# EAGLE design LED-bas (EAGLE 7.6.0)
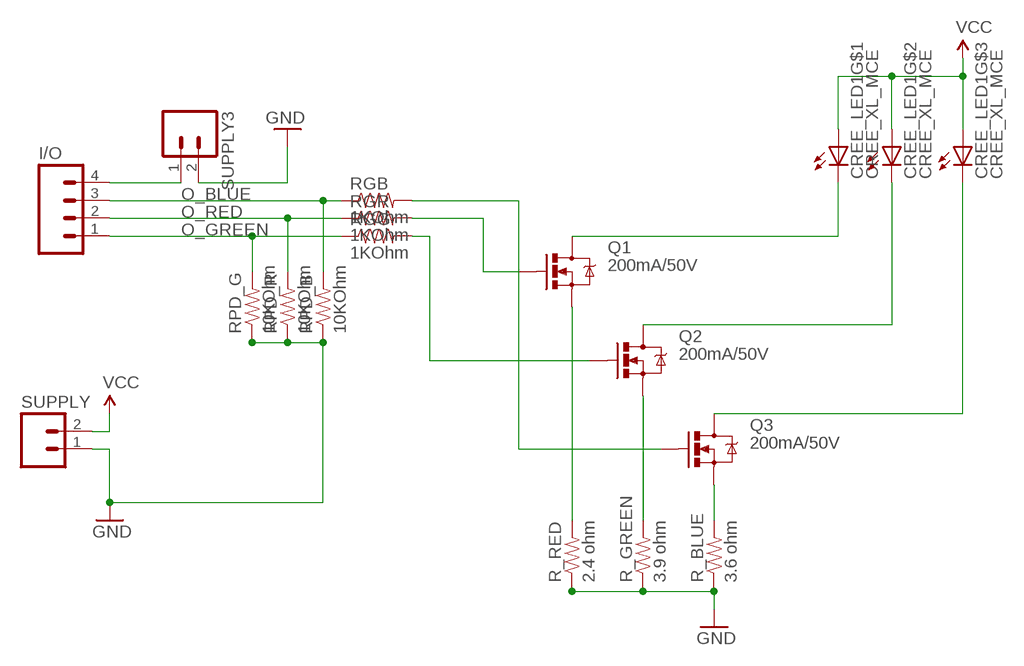
[diagram p0: schematic, sheet 1]

## Parts
CREE_LED1  CREE_XL_MCE  [CREE_XL_MCE]
I/O  M04NO_SILK_ALL_ROUND  [1X04_NO_SILK_ALL_ROUND]
Q1  200mA/50V  MOSFET-NCHANNELBSS138  [SOT23-3]
Q2  200mA/50V  MOSFET-NCHANNELBSS138  [SOT23-3]
Q3  200mA/50V  MOSFET-NCHANNELBSS138  [SOT23-3]
R_BLUE  3.6 ohm  RESISTOR0805-RES  [0805]
R_GREEN  3.9 ohm  RESISTOR0805-RES  [0805]
R_RED  2.4 ohm  RESISTOR0805-RES  [0805]
RGB  1KOhm  RESISTOR0805-RES  [0805]
RGG  1KOhm  RESISTOR0805-RES  [0805]
RGR  1KOhm  RESISTOR0805-RES  [0805]
RPD_B  10KOhm  RESISTOR0805-RES  [0805]
RPD_G  10KOhm  RESISTOR0805-RES  [0805]
RPD_R  10KOhm  RESISTOR0805-RES  [0805]
SUPPLY  M021X02_NO_SILK  [1X02_NO_SILK]
SUPPLY3  M021X02_NO_SILK  [1X02_NO_SILK]

## Nets
GND: R_BLUE.1 R_GREEN.1 R_RED.1 RPD_B.1 RPD_G.1 RPD_R.1 SUPPLY3.2 SUPPLY.1
N$1 [SUPPLY]: Q3.2(S) R_BLUE.2
N$2 [SUPPLY]: Q2.2(S) R_GREEN.2
N$3 [SUPPLY]: Q1.2(S) R_RED.2
N$4: Q2.1(G) RGG.2
N$5: Q1.1(G) RGR.2
N$6: Q3.1(G) RGB.2
N$7 [SUPPLY]: CREE_LED1.8(C) Q1.3(D)
N$8 [SUPPLY]: CREE_LED1.7(C) Q2.3(D)
N$9 [SUPPLY]: CREE_LED1.6(C) Q3.3(D)
N$10: I/O.4 SUPPLY3.1
O_BLUE: I/O.3 RGB.1 RPD_B.2
O_GREEN: I/O.1 RGG.1 RPD_G.2
O_RED: I/O.2 RGR.1 RPD_R.2
VCC [SUPPLY]: CREE_LED1.1(A) CREE_LED1.2(A) CREE_LED1.3(A) SUPPLY.2
Unconnected: CREE_LED1.4(A) CREE_LED1.5(C) CREE_LED1.HT(TH:TH)

## Library data of the parts
CREE_LED1 = CreeXL-MC-E:CREE_XL_MCE: Cree® LED
I/O = SparkFun-Connectors:M04: Header 4 Standard 4-pin 0.1" header. Use with straight break away headers (SKU : PRT-00116), right angle break away headers (PRT-00553), swiss pins (PRT-00743), machine pins (PRT-00117), and female headers (PRT-00115). Molex polarized connector foot print use with SKU : PRT-08231 with associated crimp pins and housings. 1MM SMD Version SKU: PRT-10208; PROD_ID: CONN-09696
Q1-Q3 = SparkFun-DiscreteSemi:MOSFET-NCHANNEL: Common NMOSFET Parts MFG P/N Store ID Prod ID FDD8780 TRANS-09984 SI7820DN TRANS-11055 FDS6630A IC-08089 2N7002PW TRANS-11151 FQP30N06L COM-10213 TRANS-10060 BSS123LT1G TRANS-08345 BSS138 TRANS-00830 BS170 2N7000; PROD_ID: TRANS-00830
R_BLUE R_GREEN R_RED RGB RGG RGR RPD_B RPD_G RPD_R = SparkFun-Resistors:RESISTOR: Resistor Basic schematic elements and footprints for 0603, 1206, and PTH resistors.
SUPPLY SUPPLY3 = SparkFun-Connectors:M02: Standard 2-pin 0.1" header. Use with - straight break away headers ( PRT-00116) - right angle break away headers (PRT-00553) - swiss pins (PRT-00743) - machine pins (PRT-00117) - female headers (PRT-00115) Molex polarized connector foot print use with: PRT-08233 with associated crimp pins and housings. 2.54_SCREWTERM for use with PRT-10571. 3.5mm Screw Terminal footprints for PRT-08084 5mm Screw Terminal footprints for use with PRT-08432

## Net classes
0 default: width 0.3 mm
1 GND: width 0.5 mm, clearance 0.5 mm
2 SUPPLY: width 0.5 mm, clearance 0.003 mm

## Board
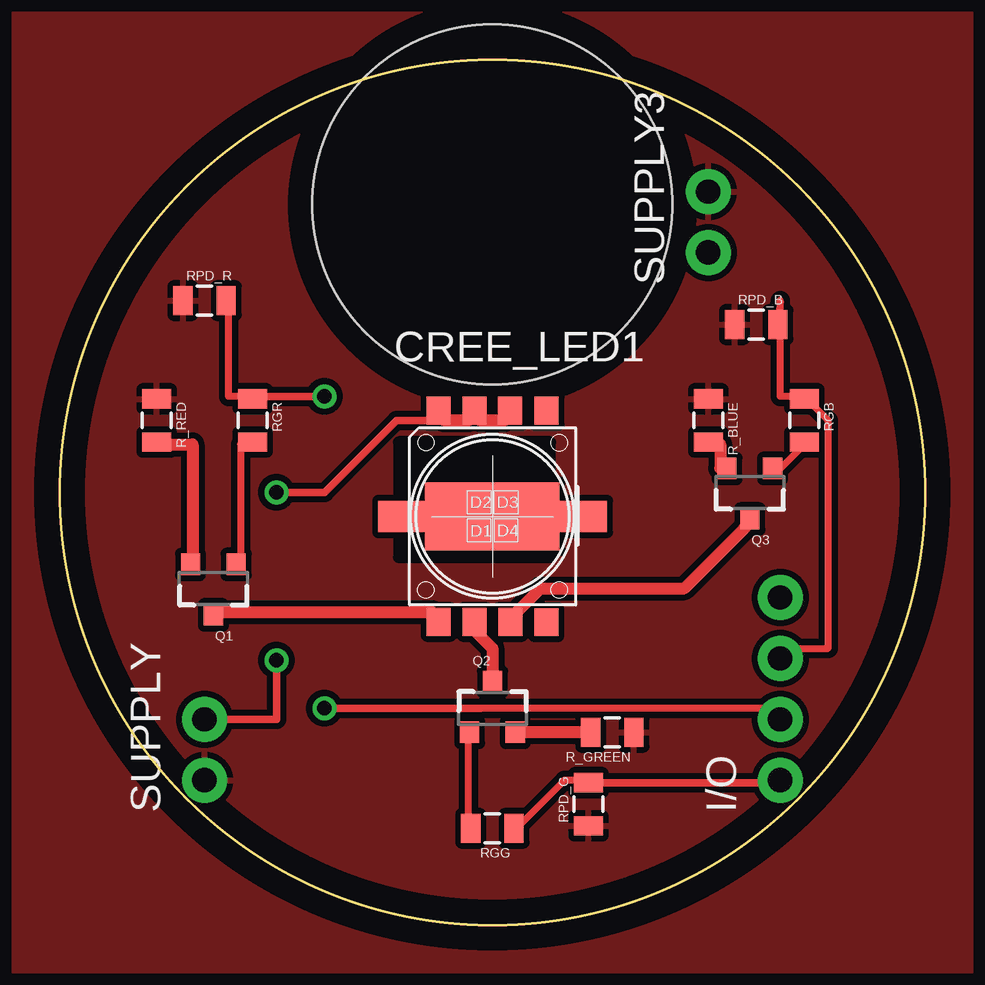
[diagram p1: board, top side]
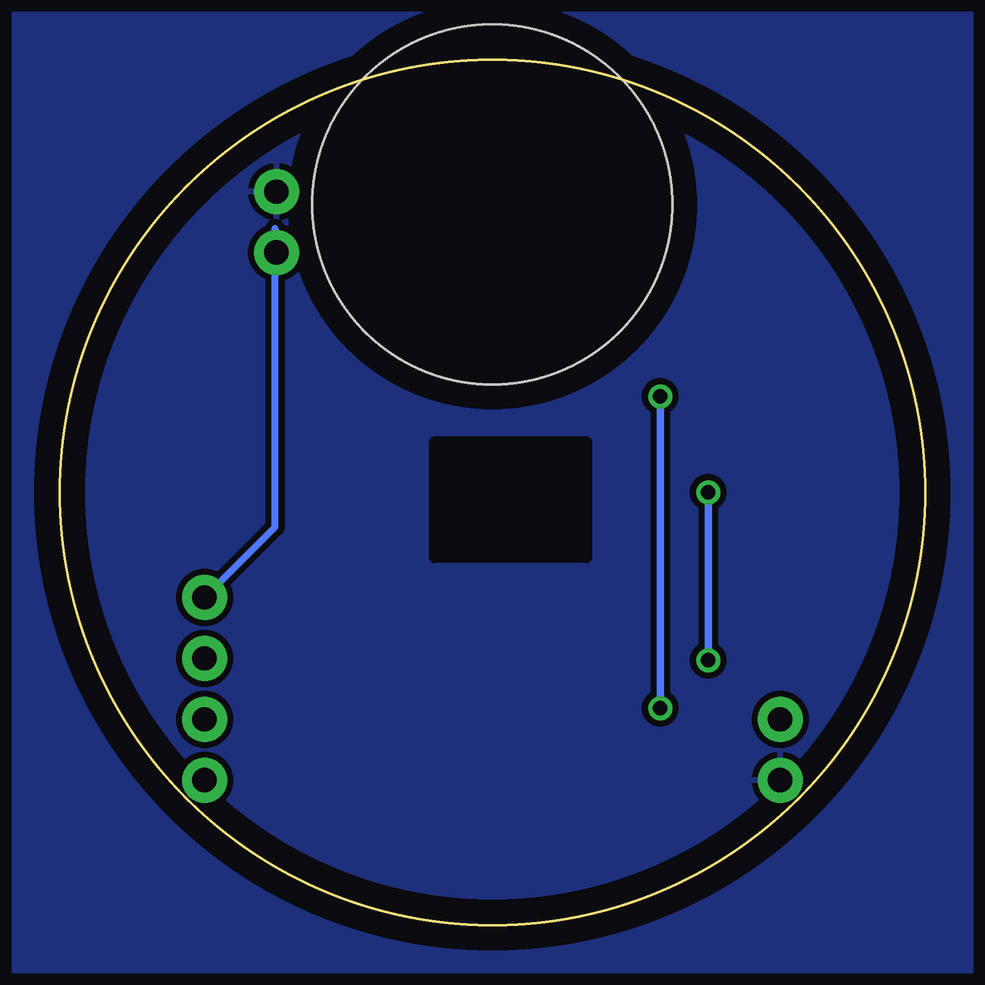
[diagram p2: board, bottom side, seen from below]

Size 36.06 x 36.06 mm. Coordinates in mm from the lower left corner, seen from the top.
Outline: circle at 18.03,18.03 radius 18.03
Copper layers (1*16): Top 0.035mm / dielectric 1.5mm / Bottom 0.035mm
Design rules "baballe": minimum track width 5mil, minimum drill 24mil, track to track 4mil, track to pad 4mil, pad to pad 4mil, via to via 4mil, smd to smd 2mil, copper to edge 40mil, drill to drill 8mil, minimum pad ring 10mil, minimum via ring 8mil, stop-mask expansion 4mil, vias tented up to drill 0mil, thermal gap 10mil
Holes 15 mm at 18.03,30.03
tRestrict: area 14.1,15.3 to 20.4,20.1
bRestrict: area 14.1,15.3 to 20.4,20.1

### Footprints (pad centres in the part's own frame; a part is rotated, then mirrored left to right if it is on the bottom)
CREE_XL_MCE = smd 1 x 1.16: 1 -2.24,4.42; 2 -0.739,4.408; 3 0.739,4.408; 4 2.256,4.408; 5 2.246,-4.408; 6 0.749,-4.399; 7 -0.739,-4.399; 8 -2.237,-4.399 | smd 5.6 x 2.84: HT 0,0 | smd 2 x 1.3: P$9 3.778,0; P$10 -3.767,0
1X04_NO_SILK_ALL_ROUND = drill 1.016 pad 1.88: 1 0,0; 2 2.54,0; 3 5.08,0; 4 7.62,0
SOT23-3 = smd 0.8 x 0.9: 1 -0.95,-1; 2 0.95,-1; 3 0,1.1
0805 = smd 0.8 x 1.2: 1 -0.9,0; 2 0.9,0
1X02_NO_SILK = drill 1.016 pad 1.88: 1 0,0; 2 2.54,0

### Placement (x,y rotation side)
CREE_LED1  18.03,17.03 0 top
I/O  30.03,6.03 90 top
Q1  6.39,14.03 180 top
Q2  18.03,9.03 0 top
Q3  28.76,18.03 180 top
R_BLUE  27.03,21.03 270 top
R_GREEN  23.03,8.03 180 top
R_RED  4.03,21.03 270 top
RGB  31.03,21.03 270 top
RGG  18.03,4.03 180 top
RGR  8.03,21.03 270 top
RPD_B  29.03,25.03 0 top
RPD_G  22.03,5.03 90 top
RPD_R  6.03,26.03 0 top
SUPPLY  6.03,6.03 90 top
SUPPLY3  27.03,28.03 90 top

### Tracks (layer width: path | path; a pad name or v marks a point on that pad's centre or on a via)
GND
  pour Top (isolate 0.254): -0.97,38.03 38.03,38.03 38.03,-1.97 -1.97,-1.97 -1.97,38.03
  pour Bottom (isolate 0.254): -0.97,38.03 38.03,38.03 38.03,-1.97 -1.97,-1.97 -1.97,38.03
N$1
  Top 0.5: Q3.2 27.53,19.03 27.53,20.03 27.03,20.03 R_BLUE.2
N$2
  Top 0.5: R_GREEN.2 Q2.2
N$3
  Top 0.5: Q1.2 5.53,15.03 5.53,20.03 4.03,20.03 R_RED.2
N$4
  Top 0.3: Q2.1 17.03,8.03 17.03,4.03 RGG.2
N$5
  Top 0.3: Q1.1 7.53,15.03 7.53,20.03 8.03,20.03 RGR.2
N$6
  Top 0.3: Q3.1 30.03,19.03 31.03,20.03 RGB.2
N$7
  Top 0.5: Q1.3 6.53,13.03 15.53,13.03 CREE_LED1.8
N$8
  Top 0.5: Q2.3 18.03,11.53 17.03,12.53 CREE_LED1.7
N$9
  Top 0.5: Q3.3 28.53,16.53 26.03,14.03 20.03,14.03 19.03,13.03 CREE_LED1.6
N$10
  Bottom 0.3: SUPPLY3.1 27.09,29.03 27.09,16.58 30,13.67 I/O.4
O_BLUE
  Top 0.3: 31.03,22.03 30.03,22.03 30.03,26.03 RPD_B.2 | 31.03,22.03 32.03,21.03 32.03,11.53 30.03,11.53 I/O.3 | 31.03,22.03 RGB.1
O_GREEN
  Top 0.3: RGG.1 19.03,4.03 21.03,6.03 22.03,6.03 RPD_G.2
  Top 0.305: RPD_G.2 30.03,5.93 I/O.1
O_RED  (via drill 0.6)
  Top 0.3: RPD_R.2 7.03,26.03 7.03,22.03 8.03,22.03 RGR.1 | 17.53,9.03 30.03,9.03 I/O.2
  Top 0.305: 17.53,9.03 v11.03,9.03 | 8.03,22.03 v11.03,22.03
  Bottom 0.305: v11.03,9.03 v11.03,22.03
VCC  (via drill 0.6)
  Top 0.305: SUPPLY.2 9.03,8.57 v9.03,11.03 | v9.03,18.03 11.03,18.03 14.03,21.03 18.36,21.03 CREE_LED1.3
  Top 0.5: CREE_LED1.3 18.53,21.03 17.53,21.03 CREE_LED1.2 17.03,21.03 16.03,21.03 CREE_LED1.1
  Bottom 0.305: v9.03,11.03 v9.03,18.03